# EAGLE schematic ojacevalec (EAGLE 6.5.0)
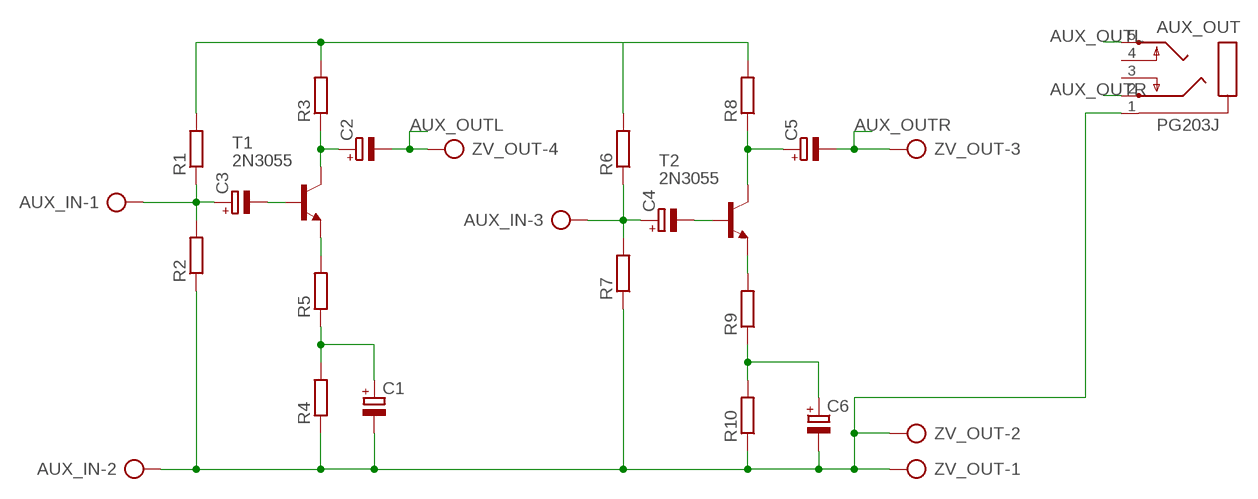
[diagram p0: schematic, sheet 1]

## Parts
AUX_IN  AK300/3  [AK300/3]
AUX_OUT  PG203J  [PG203J]
C1  CPOL-EUTT5D10  [TT5D10]
C2  CPOL-EUTT5D10  [TT5D10]
C3  CPOL-EUTT5D10  [TT5D10]
C4  CPOL-EUTT5D10  [TT5D10]
C5  CPOL-EUTT5D10  [TT5D10]
C6  CPOL-EUTT5D10  [TT5D10]
R1  R-EU_0309/12  [0309/12]
R2  R-EU_0309/12  [0309/12]
R3  R-EU_0309/12  [0309/12]
R4  R-EU_0309/12  [0309/12]
R5  R-EU_0309/12  [0309/12]
R6  R-EU_0309/12  [0309/12]
R7  R-EU_0309/12  [0309/12]
R8  R-EU_0309/12  [0309/12]
R9  R-EU_0309/12  [0309/12]
R10  R-EU_0309/12  [0309/12]
T1  2N3055  [TO3]
T2  2N3055  [TO3]
ZV_OUT  AK300/4  [AK300/4]

## Nets
AUX_OUTL: AUX_OUT.5 C2.- ZV_OUT.4
AUX_OUTR: AUX_OUT.2 C5.- ZV_OUT.3
GND: AUX_IN.2 AUX_OUT.1 C1.- C6.- R2.1 R4.1 R7.1 R10.1 ZV_OUT.1 ZV_OUT.2
N$1: AUX_IN.1 C3.+ R1.1 R2.2
N$2: C3.- T1.B
N$3: C2.+ R3.1 T1.C T1.C/(C)
N$4: R5.2 T1.E
N$5: C1.+ R4.2 R5.1
N$6: C6.+ R9.1 R10.2
N$8: R9.2 T2.E
N$10: AUX_IN.3 C4.+ R6.1 R7.2
N$11: C4.- T2.B
N$12: C5.+ R8.1 T2.C T2.C/(C)
VCC: R1.2 R3.2 R6.2 R8.2
Unconnected: AUX_OUT.3 AUX_OUT.4

## Library data of the parts
AUX_IN = con-ptr500:AK300/3: CONNECTOR; OC_FARNELL: unknown; OC_NEWARK: unknown
AUX_OUT = con-hirschmann:PG203J: MIC/HEADPHONE JACK KS-S stereo microphone/headphone jack PG203JN (Schukat); OC_FARNELL: unknown; OC_NEWARK: unknown
C1-C6 = rcl:CPOL-EU: POLARIZED CAPACITOR, European symbol
R1-R10 = rcl:R-EU_: RESISTOR, European symbol
T1 T2 = transistor:2N3055: NPN TRANSISTOR
ZV_OUT = con-ptr500:AK300/4: CONNECTOR; OC_FARNELL: unknown; OC_NEWARK: unknown